# Altium schematic sheet BGA LEDs B.SchDoc: Schematic Sheet Test Title
size 289 x 193 mm; Organization: CXQ; Address1: RM 7401, 550 Jumen Rd, Huangpu District, Shanghai, China; Address2: Huangpu District; Address3: Shanghai; Address4: China; Revision: MB0004-01.A.1; SheetNumber: 1; SheetTotal: 99; PageSetup: Record=PageOptions|CenterHorizontal=True|CenterVertical=True|PrintScale=0.98|XCorrection=1.00|YCorrection=1.00|PrintKind=0|BorderSize=5000000|LeftOffset=0|BottomOffset=0|Orientation=2|PaperLength=1000|PaperWidth=1000|Scale=100|PaperSource=7|PrintQuality=-4|MediaType=1|DitherType=10|PaperKind=A4|PrintScaleMode=1; ProjectName: Project Name
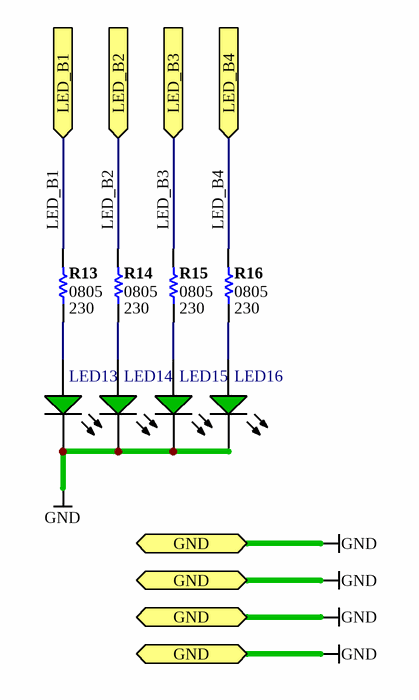
[diagram p0: BGA LEDs B.SchDoc]

## Parts
LED13  LED_1206  [RESC0805(2012)70_L]  (value not drawn)
LED14  LED_1206  [RESC0805(2012)70_L]  (value not drawn)
LED15  LED_1206  [RESC0805(2012)70_L]  (value not drawn)
LED16  LED_1206  [RESC0805(2012)70_L]  (value not drawn)
R13  0805  Value (Ohms): 230  [RESC0805(2012)70_L]
R14  0805  Value (Ohms): 230  [RESC0805(2012)70_L]
R15  0805  Value (Ohms): 230  [RESC0805(2012)70_L]
R16  0805  Value (Ohms): 230  [RESC0805(2012)70_L]

## Ports
GND, LED_B1 (in), LED_B2 (in), LED_B3 (in), LED_B4 (in)

## Nets
GND: LED13.2(K) LED14.2(K) LED15.2(K) LED16.2(K) ; port GND
LED_B1: R13.2 ; port LED_B1
LED_B2: R14.2 ; port LED_B2
LED_B3: R15.2 ; port LED_B3
LED_B4: R16.2 ; port LED_B4
NetLED13_1: LED13.1(A) R13.1
NetLED14_1: LED14.1(A) R14.1
NetLED15_1: LED15.1(A) R15.1
NetLED16_1: LED16.1(A) R16.1

## Notes on the sheet
- A4
- DOCUMENT
- DATE
- TIME
- of
- SHEET
- ADDR
- FILE
- RM 7401, 550 Jumen Road
- Huangpu District, Shanghai, China
- www.mesheven.com

## Library data of the parts
LED13-LED16 = CMP-0201-0036: GREEN color, 1206, SMD; Manufacturer_PN: 1206-LED-GREEN; DefaultDesignator: LED?; Class: Diodes; Sub Class: LED; ID: CMP-0201-0036; Reverse Voltage DC (Vr): Green; ComponentLink1Description: Datasheet; ComponentLink2Description: Manufacturer
R13-R16 = CMP-0501-0000: Jumper 0805 (2012 Metric); Value: 0R; Case-EIA: 1206; Case-Metric: 2012; Temp Coefficient ppm/°C: None; ID: CMP-0501-0000; Tolerance %: None; Power: None; Technology: SMT